# EAGLE design MSP_Breakout (EAGLE 7.5.0)
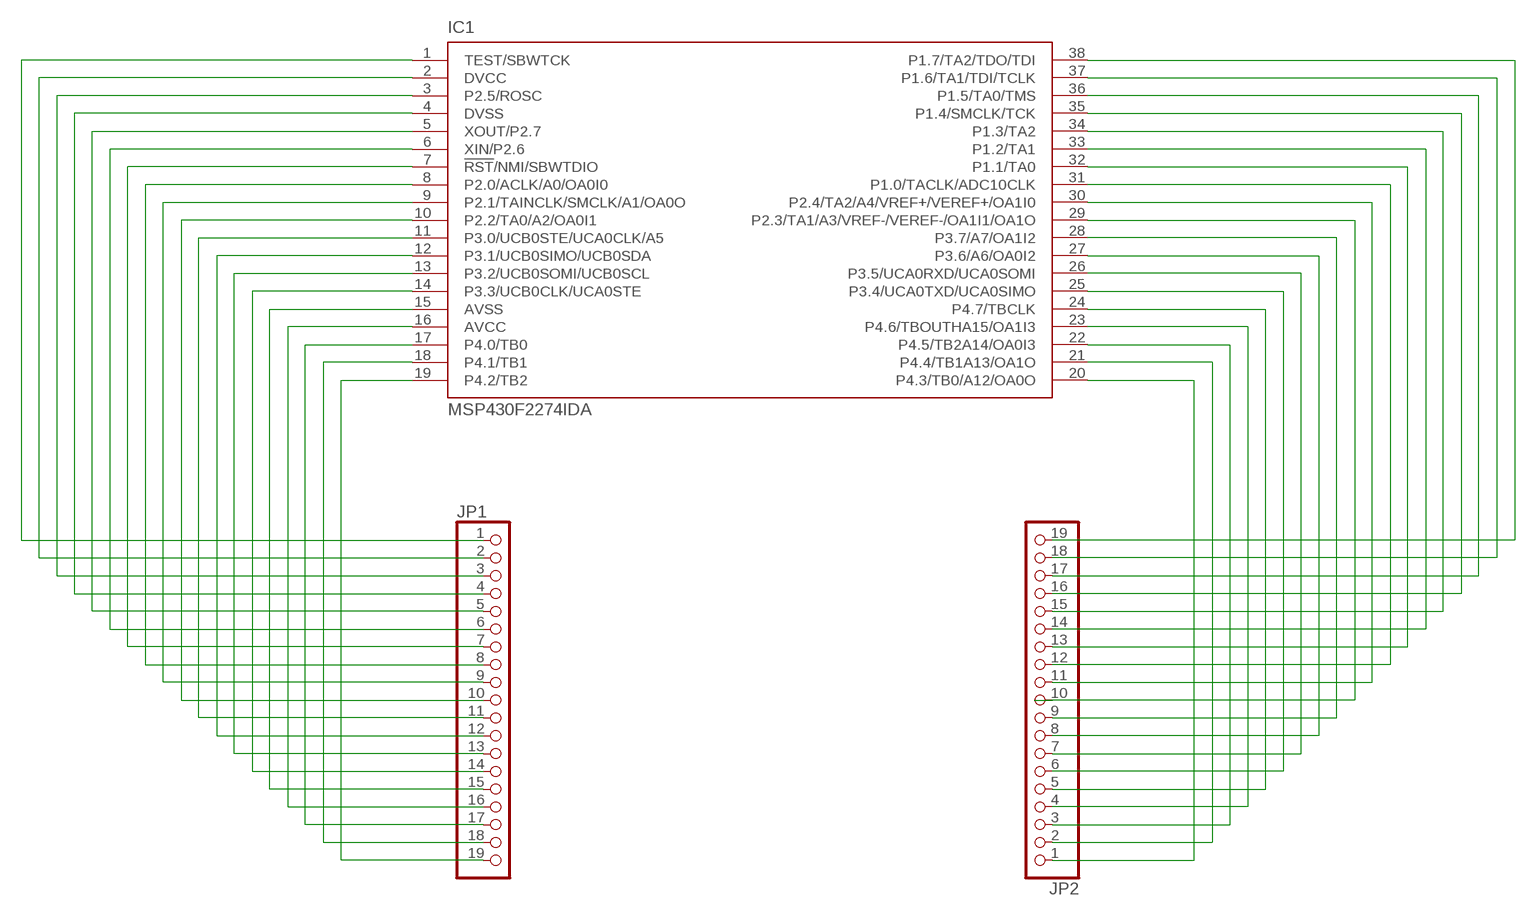
[diagram p0: schematic, sheet 1]

## Parts
IC1  MSP430F2274IDA  [TSSOP38_R-PDSO-G38-DA]
JP1  PINHD-1X19  [1X19]
JP2  PINHD-1X19  [1X19]

## Nets
N$1: IC1.1(TEST/SBWTCK) JP1.1
N$2: IC1.2(DVCC) JP1.2
N$3: IC1.3(P2.5/ROSC) JP1.3
N$4: IC1.4(DVSS) JP1.4
N$5: IC1.5(XOUT/P2.7) JP1.5
N$6: IC1.6(XIN/P2.6) JP1.6
N$7: IC1.7(!RST!/NMI/SBWTDIO) JP1.7
N$8: IC1.8(P2.0/ACLK/A0/OA0I0) JP1.8
N$9: IC1.9(P2.1/TAINCLK/SMCLK/A1/OA0O) JP1.9
N$10: IC1.10(P2.2/TA0/A2/OA0I1) JP1.10
N$11: IC1.11(P3.0/UCB0STE/UCA0CLK/A5) JP1.11
N$12: IC1.12(P3.1/UCB0SIMO/UCB0SDA) JP1.12
N$13: IC1.13(P3.2/UCB0SOMI/UCB0SCL) JP1.13
N$14: IC1.14(P3.3/UCB0CLK/UCA0STE) JP1.14
N$15: IC1.15(AVSS) JP1.15
N$16: IC1.16(AVCC) JP1.16
N$17: IC1.17(P4.0/TB0) JP1.17
N$18: IC1.18(P4.1/TB1) JP1.18
N$19: IC1.19(P4.2/TB2) JP1.19
N$20: IC1.38(P1.7/TA2/TDO/TDI) JP2.19
N$21: IC1.37(P1.6/TA1/TDI/TCLK) JP2.18
N$22: IC1.36(P1.5/TA0/TMS) JP2.17
N$23: IC1.35(P1.4/SMCLK/TCK) JP2.16
N$24: IC1.34(P1.3/TA2) JP2.15
N$25: IC1.33(P1.2/TA1) JP2.14
N$26: IC1.32(P1.1/TA0) JP2.13
N$27: IC1.31(P1.0/TACLK/ADC10CLK) JP2.12
N$28: IC1.30(P2.4/TA2/A4/VREF+/VEREF+/OA1I0) JP2.11
N$29: IC1.29(P2.3/TA1/A3/VREF-/VEREF-/OA1I1/OA1O) JP2.10
N$30: IC1.28(P3.7/A7/OA1I2) JP2.9
N$31: IC1.27(P3.6/A6/OA0I2) JP2.8
N$32: IC1.26(P3.5/UCA0RXD/UCA0SOMI) JP2.7
N$33: IC1.25(P3.4/UCA0TXD/UCA0SIMO) JP2.6
N$34: IC1.24(P4.7/TBCLK) JP2.5
N$35: IC1.23(P4.6/TBOUTHA15/OA1I3) JP2.4
N$36: IC1.22(P4.5/TB2A14/OA0I3) JP2.3
N$37: IC1.21(P4.4/TB1A13/OA1O) JP2.2
N$38: IC1.20(P4.3/TB0/A12/OA0O) JP2.1

## Library data of the parts
IC1 = texas:MSP430F22*4IDA: MIXED SIGNAL MICROCONTROLLER Source: http://focus.ti.com/lit/ds/symlink/msp430f2274.pdf; MPN: MSP430F2274IDA; OC_FARNELL: 1610179; OC_NEWARK: 28M6350
JP1 JP2 = pinhead:PINHD-1X19: PIN HEADER

## Board
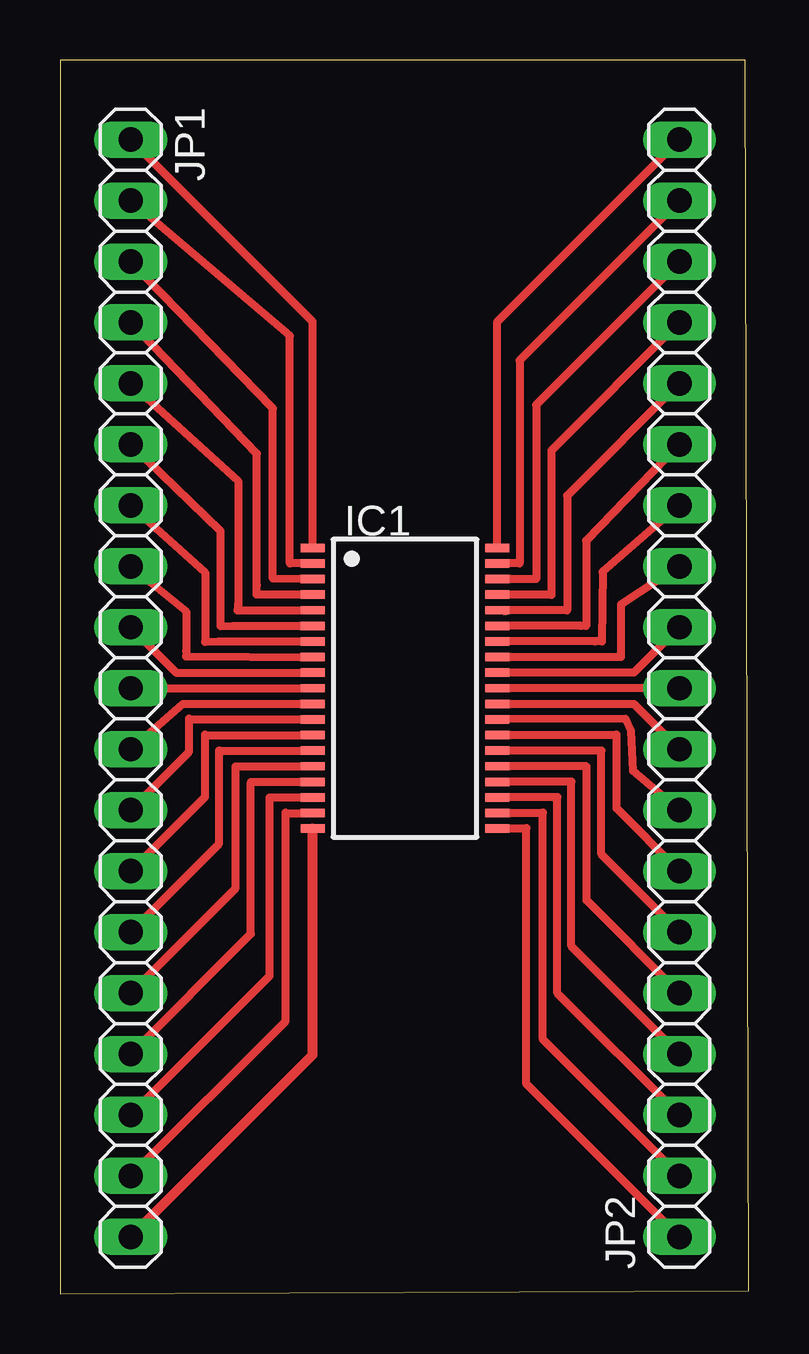
[diagram p1: board, top side]

Size 28.7 x 51.4 mm. Coordinates in mm from the lower left corner, seen from the top.
Outline: 0,0 28.7,0.13 28.55,51.4 0,51.4 0,0
Copper layers (1*16): Top 0.035mm / dielectric 1.5mm / Bottom 0.035mm
Design rules "MWSEagleDesignRules2 *": minimum track width 13mil, minimum drill 22mil, track to track 10mil, track to pad 10mil, pad to pad 10mil, via to via 10mil, smd to smd 8mil, copper to edge 40mil, drill to drill 8mil, minimum pad ring 10mil, minimum via ring 8mil, stop-mask expansion 4mil, vias tented up to drill 0mil, thermal gap 10mil

### Footprints (pad centres in the part's own frame; a part is rotated, then mirrored left to right if it is on the bottom)
TSSOP38_R-PDSO-G38-DA = smd 0.35 x 1: 1 -5.85,-3.85; 2 -5.2,-3.85; 3 -4.55,-3.85; 4 -3.9,-3.85; 5 -3.25,-3.85; 6 -2.6,-3.85; 7 -1.95,-3.85; 8 -1.3,-3.85; 9 -0.65,-3.85; 10 0,-3.85; 11 0.65,-3.85; 12 1.3,-3.85; 13 1.95,-3.85; 14 2.6,-3.85; 15 3.25,-3.85; 16 3.9,-3.85; 17 4.55,-3.85; 18 5.2,-3.85; 19 5.85,-3.85; 20 5.85,3.85; 21 5.2,3.85; 22 4.55,3.85; 23 3.9,3.85; 24 3.25,3.85; 25 2.6,3.85; 26 1.95,3.85; 27 1.3,3.85; 28 0.65,3.85; 29 0,3.85; 30 -0.65,3.85; 31 -1.3,3.85; 32 -1.95,3.85; 33 -2.6,3.85; 34 -3.25,3.85; 35 -3.9,3.85; 36 -4.55,3.85; 37 -5.2,3.85; 38 -5.85,3.85
1X19 = drill 1.016 long: 1 -22.86,0; 2 -20.32,0; 3 -17.78,0; 4 -15.24,0; 5 -12.7,0; 6 -10.16,0; 7 -7.62,0; 8 -5.08,0; 9 -2.54,0; 10 0,0; 11 2.54,0; 12 5.08,0; 13 7.62,0; 14 10.16,0; 15 12.7,0; 16 15.24,0; 17 17.78,0; 18 20.32,0; 19 22.86,0

### Placement (x,y rotation side)
IC1  14.38,25.22 270 top
JP1  2.95,25.22 270 top
JP2  25.81,25.22 90 top

### Tracks (layer width: path | path; a pad name or v marks a point on that pad's centre or on a via)
N$1
  Top 0.33: IC1.1 10.53,40.5 JP1.1
N$2
  Top 0.33: IC1.2 9.58,30.43 9.58,39.9 JP1.2
N$3
  Top 0.33: IC1.3 8.87,29.79 8.87,36.88 JP1.3
N$4
  Top 0.33: IC1.4 8.19,29.12 8.2,29.52 8.2,35 JP1.4
N$5
  Top 0.33: JP1.5 7.42,33.86 7.42,28.7 7.39,28.47 IC1.5
N$6
  Top 0.33: JP1.6 6.68,31.77 6.68,27.81 7.2,27.82 IC1.6
N$7
  Top 0.33: JP1.7 6.04,30.05 6.04,27.15 6.61,27.17 IC1.7
N$8
  Top 0.33: JP1.8 5.26,28.42 5.26,26.77 5.25,26.55 IC1.8
N$9
  Top 0.33: JP1.9 4.84,25.87 IC1.9
N$10
  Top 0.33: JP1.10 IC1.10
N$11
  Top 0.33: JP1.11 5.12,24.57 IC1.11
N$12
  Top 0.33: IC1.12 5.42,23.92 5.38,23.95 5.38,22.58 JP1.12
N$13
  Top 0.33: JP1.13 6.04,20.7 6.04,23.29 6.07,23.27 IC1.13
N$14
  Top 0.33: JP1.14 6.63,18.75 6.63,22.63 6.64,22.62 IC1.14
N$15
  Top 0.33: JP1.15 7.32,16.89 7.32,21.97 IC1.15
N$16
  Top 0.33: JP1.16 7.95,14.99 7.95,21.31 7.96,21.32 IC1.16
N$17
  Top 0.33: JP1.17 8.74,13.23 8.74,20.68 8.74,20.67 IC1.17
N$18
  Top 0.33: JP1.18 9.4,11.35 9.4,20.04 9.42,20.02 IC1.18
N$19
  Top 0.406: JP1.19 10.53,9.94 IC1.19
N$20
  Top 0.33: IC1.38 18.23,40.5 JP2.19
N$21
  Top 0.33: JP2.18 19.15,38.89 19.15,30.43 19.14,30.42 IC1.37
N$22
  Top 0.33: JP2.17 19.84,37.03 19.84,29.77 19.83,29.77 IC1.36
N$23
  Top 0.33: JP2.16 20.47,35.13 20.47,29.11 20.46,29.12 IC1.35
N$24
  Top 0.33: 18.52,28.45 18.59,28.45 18.59,28.47 IC1.34 21.13,28.47 21.13,33.25 JP2.15
N$25
  Top 0.33: JP2.14 21.92,31.37 21.92,27.81 21.71,27.82 IC1.33
N$26
  Top 0.33: JP2.13 22.61,30.07 22.58,27.18 22.3,27.17 IC1.32
N$27
  Top 0.33: JP2.12 23.37,28.7 23.37,26.52 22.83,26.52 IC1.31
N$28
  Top 0.33: JP2.11 23.92,25.87 IC1.30
N$29
  Top 0.33: JP2.10 IC1.29
N$30
  Top 0.33: IC1.28 23.92,24.57 JP2.9
N$31
  Top 0.33: JP2.8 23.88,21.77 23.8,23.44 23.57,23.95 IC1.27
N$32
  Top 0.33: JP2.7 23.19,20.22 23.19,23.29 23.17,23.27 IC1.26
N$33
  Top 0.33: JP2.6 22.55,18.31 22.55,22.63 22.55,22.62 IC1.25
N$34
  Top 0.33: JP2.5 21.95,16.38 21.95,21.97 21.94,21.97 IC1.24
N$35
  Top 0.33: JP2.4 21.31,14.48 21.31,21.34 21.3,21.32 IC1.23
N$36
  Top 0.33: JP2.3 20.73,12.52 20.73,20.7 20.7,20.67 IC1.22
N$37
  Top 0.33: JP2.2 20.12,10.59 20.12,20.04 20.1,20.02 IC1.21
N$38
  Top 0.33: JP2.1 19.43,8.74 19.43,19.41 19.4,19.37 IC1.20